# Altium project ESP32-Control-Board.PrjPcb
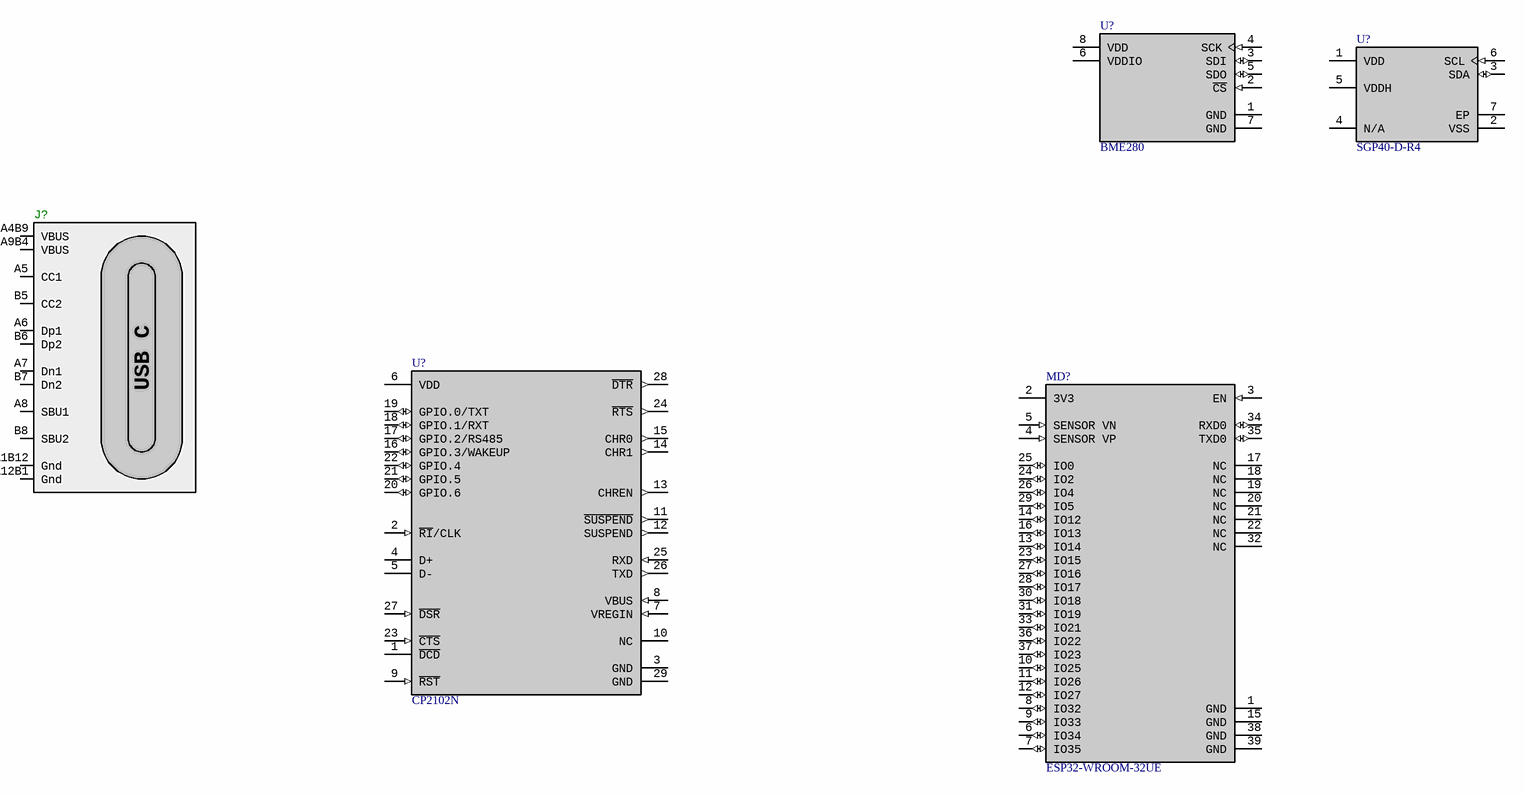
[diagram p0: X-LaserPCB.SchDoc]
ProjectDpn: ProjectDpn Not Set; ProjectLabel: ProjectLabel Not Set; ProjectPcbPn: ProjectPcbPn Not Set; ProjectRev: ProjectRev Not Set; ProjectRevDate: ProjectRevDate Not Set
2 sheets, 13 parts. Net scope: global (net labels, ports and power ports of the same name join across sheets).
Board file: X-LaserPCB.PcbDoc
Sheets:
  X-LaserPCB.SchDoc
  USB-C_FT231X.SchDoc

## Sheet X-LaserPCB.SchDoc
size Tabloid; SheetNumber: 1; SheetTotal: 2; SheetDesc: <SheetDesc>; DPN: ProjectDpn Not Set

### Parts
(Parts that share a designator on the sheet are numbered #1, #2 ... from top to bottom, then left to right.)
J?#1  (no value)  [2171790001]
MD?  ESP32-WROOM-32UE  [FP-ESP32-WROOM-32UE_4MB-MFG]
U?#1  BME280  [FP-BME280-MFG]
U?#2  SGP40-D-R4  [FP-SGP40-D-R4-IPC_A]
U?#3  CP2102N  [FP-CP2102N-A01-GQFN28-IPC_C]

### Nets

Not connected (* = marked no-connect by the designer): J?#1 A1B12(Gnd) A4B9(VBUS) A5(CC1) A6(Dp1) A7(Dn1) A8(SBU1) A9B4(VBUS) A12B1(Gnd) B5(CC2) B6(Dp2) B7(Dn2) B8(SBU2); MD? 1(GND) 2(3V3) 3(EN) 4(SENSOR_VP) 5(SENSOR_VN) 6(IO34) 7(IO35) 8(IO32) 9(IO33) 10(IO25) 11(IO26) 12(IO27) 13(IO14) 14(IO12) 15(GND) 16(IO13) 17(NC) 18(NC) 19(NC) 20(NC) 21(NC) 22(NC) 23(IO15) 24(IO2) 25(IO0) 26(IO4) 27(IO16) 28(IO17) 29(IO5) 30(IO18) 31(IO19) 32(NC) 33(IO21) 34(RXD0) 35(TXD0) 36(IO22) 37(IO23) 38(GND) 39(GND); U?#1 1(GND) 2(~{CS}) 3(SDI) 4(SCK) 5(SDO) 6(VDDIO) 7(GND) 8(VDD); U?#2 1(VDD) 2(VSS) 3(SDA) 4(N/A) 5(VDDH) 6(SCL) 7(EP); U?#3 1(~{DCD}) 2(~{RI}/CLK) 3(GND) 4(D+) 5(D-) 6(VDD) 7(VREGIN) 8(VBUS) 9(~{RST}) 10(NC) 11(~{SUSPEND}) 12(SUSPEND) 13(CHREN) 14(CHR1) 15(CHR0) 16(GPIO.3/WAKEUP) 17(GPIO.2/RS485) 18(GPIO.1/RXT) 19(GPIO.0/TXT) 20(GPIO.6) 21(GPIO.5) 22(GPIO.4) 23(~{CTS}) 24(~{RTS}) 25(RXD) 26(TXD) 27(~{DSR}) 28(~{DTR}) 29(GND)

### Notes on the sheet
- Status Stamp
- DPN:
- PN:
- Drawn By:
- Description:
- Checked by:
- The information contained in this drawing is the sole property of X-Laser, LLC.  Any reproduction or distribution in part or as a whole is prohibited without the written permission of X-Laser, LLC
- Sheet:
- of:
- Date:
- Rev:
- (in symbol 385[[/\]]Con) USB C

### Library data of the parts
J?#1 = 385[[/\]]Con: Horizontal Top Mount 16-Pin USB2.0 C Connector; MfrPns: Molex: 2171790001;; TID: Con; ID: 385; Subtype: C Receptcale; XLPN: 130-402; UOM: ea; UID: 1465; Type: USB; Subtype2: Horizontal Top Mount
MD? = ESP32-WROOM-32UE-4: WiFi-Modul 802.11/BT 2, 4-2, 5GHz 150Mb/s
U?#1 = BME280-1: SENSOR PRESSURE HUMIDITY TEMP
U?#2 = SGP40-1: Multi Gas Sensor; Reach SVHC Compliant: Yes
U?#3 = CP2102N-2: USB Bus Controller, CMOS; Max Supply Voltage: 3.6V; Nominal Supply Voltage: 3.3V; Min Supply Voltage: 3V; RoHS Compliant: Yes; Terminal Pitch: 0.5mm; Terminal Position: QUAD; Length: 5mm; Width: 5mm; Technology: CMOS; Pins: 28; Package Style: CHIP CARRIER, HEAT SINK/SLUG, VERY THIN PROFILEMeter; Terminal Form: No Lead; Reach SVHC Compliant: Yes; Height - Seated (Max): 0.8mm; Surface Mount: Yes; Temperature Grade: INDUSTRIAL; Case/Package: HVQCCN; Min Operating Temperature: -40°C; Max Operating Temperature: 85°C; Package Shape: Square

## Sheet USB-C_FT231X.SchDoc
size Tabloid; SheetNumber: 2; SheetTotal: 2; SheetDesc: <SheetDesc>; DPN: ProjectDpn Not Set
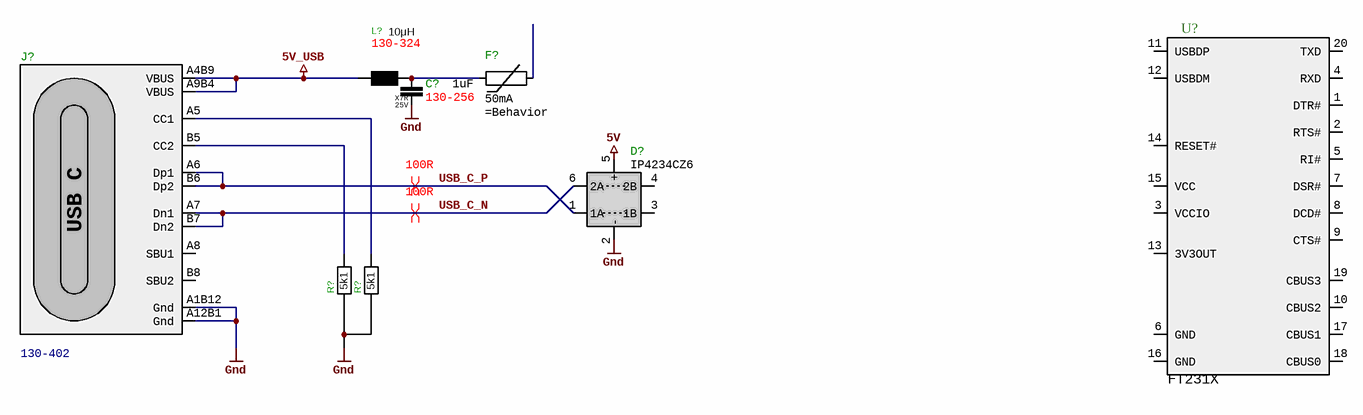
[diagram p1: USB-C_FT231X.SchDoc]

### Parts
(Parts that share a designator on the sheet are numbered #1, #2 ... from top to bottom, then left to right.)
C?  1uF  XLPN: 130-256  [CAPC2012X110L50N]
D?  IP4234CZ6  [>SOT23-6P95_265X145L35X35N]
F?  50mA  [FUSE-PTC-1206]
J?#2  XLPN: 130-402  [2171790001]
L?  10μH  XLPN: 130-324  [INDC320X180X200L60N]
R?#1  5k1  [RESC1608X85L35N]
R?#2  5k1  [RESC1608X85L35N]
U?#4  FT231X  [SOP65P600X175-20N]

### Nets
5V: D?.5(+)
5V_USB: J?#2.A4B9(VBUS) J?#2.A9B4(VBUS) L?.1
Gnd: C?.2 D?.2(-) J?#2.A1B12(Gnd) J?#2.A12B1(Gnd) R?#1.1 R?#2.1
USB_C_N: D?.6(2A) J?#2.A7(Dn1) J?#2.B7(Dn2)
USB_C_P: D?.1(1A) J?#2.A6(Dp1) J?#2.B6(Dp2)
NetC?_1: C?.1 F?.1(A) L?.2
NetJ?#2_A5: J?#2.A5(CC1) R?#2.2
NetJ?#2_B5: J?#2.B5(CC2) R?#1.2

Not connected (* = marked no-connect by the designer): D? 3(1B) 4(2B); F? 2(B); J?#2 A8(SBU1) B8(SBU2); U?#4 1(DTR#) 2(RTS#) 3(VCCIO) 4(RXD) 5(RI#) 6(GND) 7(DSR#) 8(DCD#) 9(CTS#) 10(CBUS2) 11(USBDP) 12(USBDM) 13(3V3OUT) 14(RESET#) 15(VCC) 16(GND) 17(CBUS1) 18(CBUS0) 19(CBUS3) 20(TXD)

### Layout directives
differential pair; DifferentialPairClass: 100R: USB_C_N, USB_C_P

### Notes on the sheet
- Status Stamp
- DPN:
- PN:
- Drawn By:
- Description:
- Checked by:
- The information contained in this drawing is the sole property of X-Laser, LLC.  Any reproduction or distribution in part or as a whole is prohibited without the written permission of X-Laser, LLC
- Sheet:
- of:
- Date:
- Rev:
- (in symbol 385[[/\]]Con) USB C

### Library data of the parts
C? = 6[[/\]]Cap: 1uF 10% 25 V X7R 0805 MLCC; Manufacturer 1: TDK; Manufacturer Part Number 1: C2012X7R1E105K125AB; MfrPns: Wurth Electronics: 885012207078, / Vishay/Vitramon: VJ0805Y105KXXTW1BC, / Taiyo Yuden: TMK212B7105KGHT,; TID: Cap; ID: 6; Special 2: 25V; Params: Voltage Rating: 25 V; / Dielectric: X7R; / Tolerance: 10%;; UOM: ea; UID: 67; Type: MLCC; Subtype: X7R; Value: 1uF; Supplier 1: Mouser; Supplier Part Number 1: 810-C2012X7R1E105K; Special 1: X7R; Case: 0805; Created: 9/23/2014 2:24:35 PM
D? = 42[[/\]]Dio: ESD protection array for USB 2.0; Manufacturer 1: NXP; TID: Dio; ID: 42; Type: ESD Array; UID: 364; Subtype: USB; Value: IP4234CZ6; Supplier 1: Mouser; Supplier Part Number 1: 771-IP4234CZ6125; ComponentLink1Description: Datasheet; ComponentLink1URL: http://www.mouser.com/ds/2/302/IP4234CZ6-354034.pdf; Created: 2/22/2015 2:28:54 PM; Manufacturer Part Number 1: IP4234CZ6
F? = 1[[/\]]Fus: PTC Fuse, 50mA 1206; MfrPns: Cooper Bussmann: PTS120660V005;; TID: Fus; ID: 1; Type: Resettable - PPTC; XLPN: 130-133; UOM: ea; Params: Voltage: 60 V; / Behavior: PTC; / Trip Current: 150 mA; / Hold Current: 50 mA;; Behavior: =Behavior; UID: 401; Subtype: PTC; Value: 50mA; Supplier 1: Mouser; Supplier Part Number 1: 504-PTS120660V005; Case: 1206; Created: 10/1/2014 1:47:16 PM
J?#2 = 385[[/\]]Con: Horizontal Top Mount 16-Pin USB2.0 C Connector; MfrPns: Molex: 2171790001;; TID: Con; ID: 385; Subtype: C Receptcale; UOM: ea; UID: 1465; Type: USB; Subtype2: Horizontal Top Mount
L? = 40[[/\]]Ind: 10μH 340mA Chip Inductor; Manufacturer 1: Taiyo Yuden; Manufacturer Part Number 1: LB3218T100K; TID: Ind; ID: 40; Type: Power Inductor; Subtype: SMD Chip; Subtype2: 1207; UOM: ea; UID: 823; Value: 10μH; Supplier 1: Mouser; Supplier Part Number 1: 963-LB3218T100K
R?#1 R?#2 = 74[[/\]]Res: Resistor, Thick Film 5k1R 100mW 1% 100 PPM/°C 0603; MfrPns: KOA Speer: RK73H1JTTD5101F;; TID: Res; ID: 74; Subtype2: 0603; XLPN: 130-470; UOM: ea; Params: Power Rating: 100mW; / TCR: 100 PPM/°C; / Stock 1: No; / Tolerance: 1%;; UID: 677; Type: Chip; Subtype: Thick Film; Value: 5k1; Supplier 1: Mouser; Supplier Part Number 1: 660-RK73H1JTTD5101F; ComponentLink1Description: Datasheet; ComponentLink1URL: http://www.koaspeer.com/catimages/Products/RK73H/RK73H.pdf; Case: 0603; Created: 11/2/2014 3:24:14 PM; Special 1: 1%; Special 2: 100 PPM/°C
U?#4 = 222[[/\]]Int: USB to Full Handshake UART IC; MfrPns: FTDI: FT231XS; Manufacturer 1: FTDI; TID: Int; ID: 222; Subtype: USB-UART; XLPN: 130-466; UOM: ea; UID: 1653; Type: Interface; Value: FT231X; ComponentLink1Description: Datasheet; ComponentLink1URL: https://ftdichip.com/wp-content/uploads/2021/10/DS_FT231X.pdf

## Assembly variants
Default: all parts fitted